# Altium project EmSys_K70Wn_v1.PrjPCB (part 1 of 3)
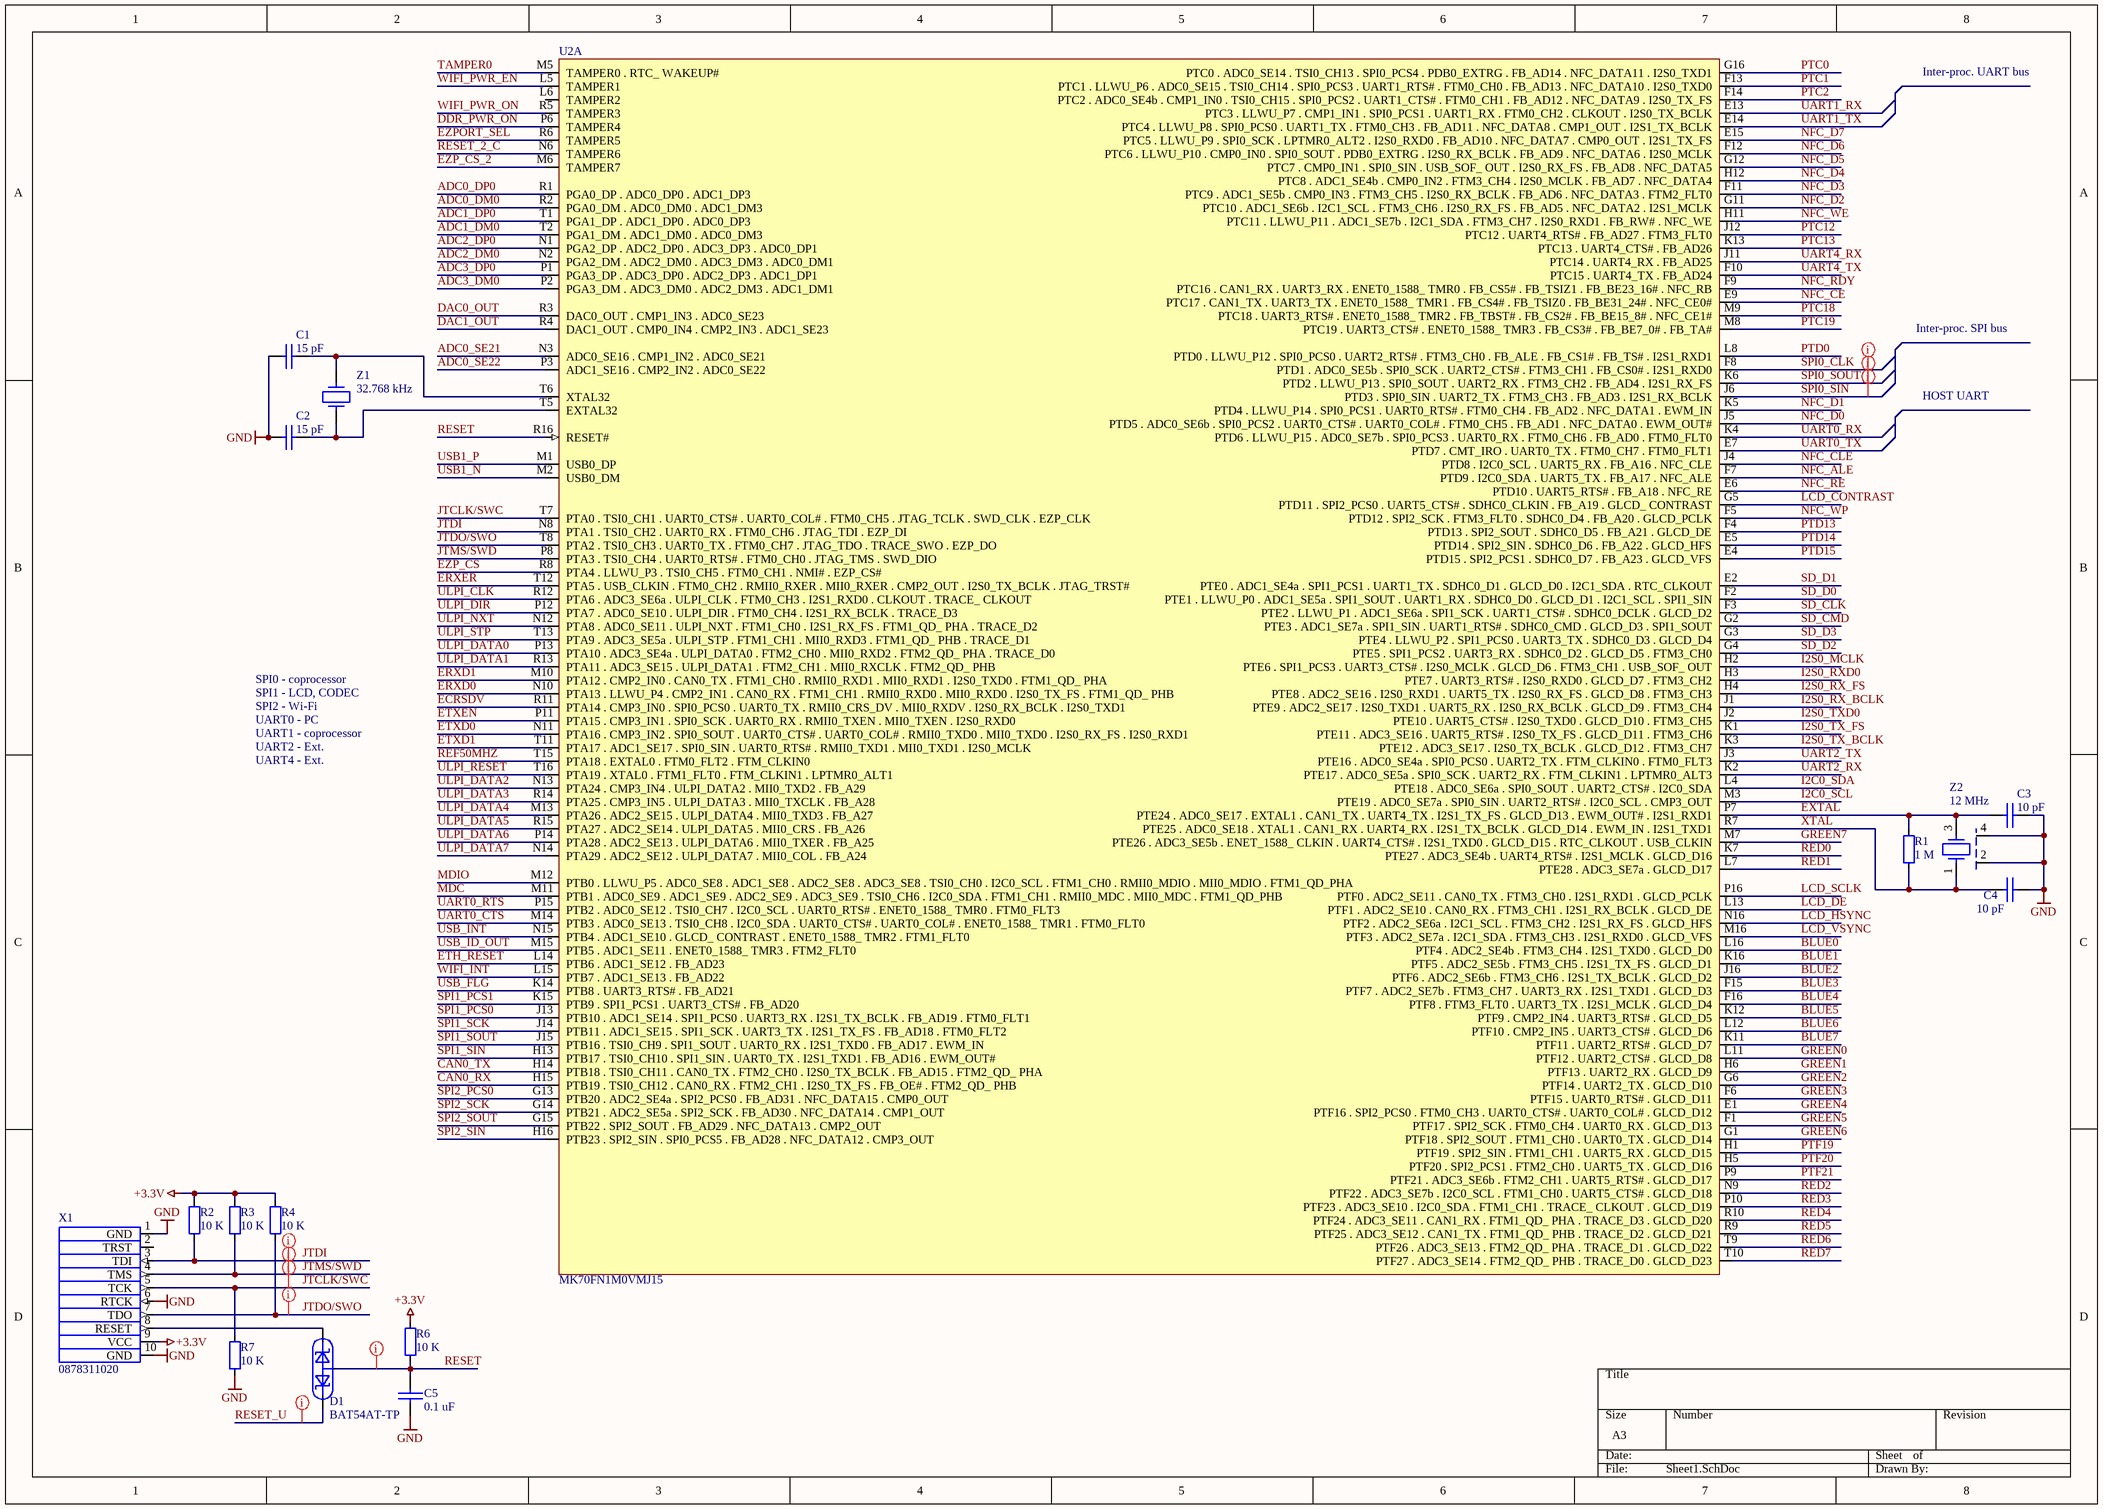
[diagram p0: Sheet1.SchDoc]
7 sheets, 344 parts. Net scope: global (net labels, ports and power ports of the same name join across sheets).
Board file: EMSYS_K70Wn_v1.PcbDoc
Sheets:
  Sheet1.SchDoc
  Sheet2.SchDoc
  Sheet3.SchDoc
  Sheet4.SchDoc
  Sheet5.SchDoc
  Sheet6.SchDoc
  Sheet7.SchDoc

## Sheet Sheet1.SchDoc
size A3; DocumentNumber: 1; SheetNumber: 1; SheetTotal: 7

### Parts
C1  value 15 pF  [1608[0603]]  (hidden comment: CC0603JRNPO9BN150)
C2  value 15 pF  [1608[0603]]  (hidden comment: CC0603JRNPO9BN150)
C3  value 10 pF  [1608[0603]]  (hidden comment: CCPF010K0603)
C4  value 10 pF  [1608[0603]]  (hidden comment: CCPF010K0603)
C5  value 0.1 uF  [1005[0402]]  (hidden comment: CL10B104KA8NNND)
D1  BAT54AT-TP  [SOT-523F]
R1  value 1 M  [0603]  (hidden comment: RC0603FR-071ML)
R2  value 10 K  [0402]  (hidden comment: ERJ-3EKF1002V)
R3  value 10 K  [0402]  (hidden comment: ERJ-3EKF1002V)
R4  value 10 K  [0402]  (hidden comment: ERJ-3EKF1002V)
R6  value 10 K  [0402]  (hidden comment: ERJ-3EKF1002V)
R7  value 10 K  [0402]  (hidden comment: ERJ-3EKF1002V)
U2  MK70FN1M0VMJ15  [MAPBGA 256-pin]  (part A of 2)
X1  0878311020  [878311020 MGRID WALL HDR SMD]
Z1  value 32.768 kHz  [ABS10]  (hidden comment: CM200C32768DZBT)
Z2  value 12 MHz  [DSX321G]  (hidden comment: NX3225SA-12.000MHZ-STD-CSR-1)

### Nets
+3.3V: R2.1 R3.1 R4.1 R6.1 X1.9(VCC)
GND: C1.2 C2.2 C3.2 C4.2 C5.2 R7.2 X1.1(GND) X1.6(RTCK) X1.10(GND) Z2.2 Z2.4
ADC0_DM0: U2.R2(PGA0_DM_._ADC0_DM0_._ADC1_DM3)
ADC0_DP0: U2.R1(PGA0_DP_._ADC0_DP0_._ADC1_DP3)
ADC0_SE21: U2.N3(ADC0_SE16_._CMP1_IN2_._ADC0_SE21)
ADC0_SE22: U2.P3(ADC1_SE16_._CMP2_IN2_._ADC0_SE22)
ADC1_DM0: U2.T2(PGA1_DM_._ADC1_DM0_._ADC0_DM3)
ADC1_DP0: U2.T1(PGA1_DP_._ADC1_DP0_._ADC0_DP3)
ADC2_DM0: U2.N2(PGA2_DM_._ADC2_DM0_._ADC3_DM3_._ADC0_DM1)
ADC2_DP0: U2.N1(PGA2_DP_._ADC2_DP0_._ADC3_DP3_._ADC0_DP1)
ADC3_DM0: U2.P2(PGA3_DM_._ADC3_DM0_._ADC2_DM3_._ADC1_DM1)
ADC3_DP0: U2.P1(PGA3_DP_._ADC3_DP0_._ADC2_DP3_._ADC1_DP1)
BLUE0: U2.L16(PTF4_._ADC2_SE4b_._FTM3_CH4_._I2S1_TXD0_._GLCD_D0)
BLUE1: U2.K16(PTF5_._ADC2_SE5b_._FTM3_CH5_._I2S1_TX_FS_._GLCD_D1)
BLUE2: U2.J16(PTF6_._ADC2_SE6b_._FTM3_CH6_._I2S1_TX_BCLK_._GLCD_D2)
BLUE3: U2.F15(PTF7_._ADC2_SE7b_._FTM3_CH7_._UART3_RX_._I2S1_TXD1_._GLCD_D3)
BLUE4: U2.F16(PTF8_._FTM3_FLT0_._UART3_TX_._I2S1_MCLK_._GLCD_D4)
BLUE5: U2.K12(PTF9_._CMP2_IN4_._UART3_RTS#_._GLCD_D5)
BLUE6: U2.L12(PTF10_._CMP2_IN5_._UART3_CTS#_._GLCD_D6)
BLUE7: U2.K11(PTF11_._UART2_RTS#_._GLCD_D7)
CAN0_RX: U2.H15(PTB19_._TSI0_CH12_._CAN0_RX_._FTM2_CH1_._I2S0_TX_FS_._FB_OE#_._FTM2_QD__PHB)
CAN0_TX: U2.H14(PTB18_._TSI0_CH11_._CAN0_TX_._FTM2_CH0_._I2S0_TX_BCLK_._FB_AD15_._FTM2_QD__PHA)
DAC0_OUT: U2.R3(DAC0_OUT_._CMP1_IN3_._ADC0_SE23)
DAC1_OUT: U2.R4(DAC1_OUT_._CMP0_IN4_._CMP2_IN3_._ADC1_SE23)
DDR_PWR_ON: U2.P6(TAMPER4)
ECRSDV: U2.R11(PTA14_._CMP3_IN0_._SPI0_PCS0_._UART0_TX_._RMII0_CRS_DV_._MII0_RXDV_._I2S0_RX_BCLK_._I2S0_TXD1)
ERXD0: U2.N10(PTA13_._LLWU_P4_._CMP2_IN1_._CAN0_RX_._FTM1_CH1_._RMII0_RXD0_._MII0_RXD0_._I2S0_TX_FS_._FTM1_QD__PHB)
ERXD1: U2.M10(PTA12_._CMP2_IN0_._CAN0_TX_._FTM1_CH0_._RMII0_RXD1_._MII0_RXD1_._I2S0_TXD0_._FTM1_QD__PHA)
ERXER: U2.T12(PTA5_._USB_CLKIN_._FTM0_CH2_._RMII0_RXER_._MII0_RXER_._CMP2_OUT_._I2S0_TX_BCLK_._JTAG_TRST#)
ETH_RESET: U2.L14(PTB6_._ADC1_SE12_._FB_AD23)
ETXD0: U2.N11(PTA16_._CMP3_IN2_._SPI0_SOUT_._UART0_CTS#_._UART0_COL#_._RMII0_TXD0_._MII0_TXD0_._I2S0_RX_FS_._I2S0_RXD1)
ETXD1: U2.T11(PTA17_._ADC1_SE17_._SPI0_SIN_._UART0_RTS#_._RMII0_TXD1_._MII0_TXD1_._I2S0_MCLK)
ETXEN: U2.P11(PTA15_._CMP3_IN1_._SPI0_SCK_._UART0_RX_._RMII0_TXEN_._MII0_TXEN_._I2S0_RXD0)
EXTAL: C3.1 R1.2 U2.P7(PTE24_._ADC0_SE17_._EXTAL1_._CAN1_TX_._UART4_TX_._I2S1_TX_FS_._GLCD_D13_._EWM_OUT#_._I2S1_RXD1) Z2.3
EZP_CS: U2.R8(PTA4_._LLWU_P3_._TSI0_CH5_._FTM0_CH1_._NMI#_._EZP_CS#)
EZP_CS_2: U2.M6(TAMPER7)
EZPORT_SEL: U2.R6(TAMPER5)
GREEN0: U2.L11(PTF12_._UART2_CTS#_._GLCD_D8)
GREEN1: U2.H6(PTF13_._UART2_RX_._GLCD_D9)
GREEN2: U2.G6(PTF14_._UART2_TX_._GLCD_D10)
GREEN3: U2.F6(PTF15_._UART0_RTS#_._GLCD_D11)
GREEN4: U2.E1(PTF16_._SPI2_PCS0_._FTM0_CH3_._UART0_CTS#_._UART0_COL#_._GLCD_D12)
GREEN5: U2.F1(PTF17_._SPI2_SCK_._FTM0_CH4_._UART0_RX_._GLCD_D13)
GREEN6: U2.G1(PTF18_._SPI2_SOUT_._FTM1_CH0_._UART0_TX_._GLCD_D14)
GREEN7: U2.M7(PTE26_._ADC3_SE5b_._ENET_1588__CLKIN_._UART4_CTS#_._I2S1_TXD0_._GLCD_D15_._RTC_CLKOUT_._USB_CLKIN)
I2C0_SCL: U2.M3(PTE19_._ADC0_SE7a_._SPI0_SIN_._UART2_RTS#_._I2C0_SCL_._CMP3_OUT)
I2C0_SDA: U2.L4(PTE18_._ADC0_SE6a_._SPI0_SOUT_._UART2_CTS#_._I2C0_SDA)
I2S0_MCLK: U2.H2(PTE6_._SPI1_PCS3_._UART3_CTS#_._I2S0_MCLK_._GLCD_D6_._FTM3_CH1_._USB_SOF__OUT)
I2S0_RX_BCLK: U2.J1(PTE9_._ADC2_SE17_._I2S0_TXD1_._UART5_RX_._I2S0_RX_BCLK_._GLCD_D9_._FTM3_CH4)
I2S0_RX_FS: U2.H4(PTE8_._ADC2_SE16_._I2S0_RXD1_._UART5_TX_._I2S0_RX_FS_._GLCD_D8_._FTM3_CH3)
I2S0_RXD0: U2.H3(PTE7_._UART3_RTS#_._I2S0_RXD0_._GLCD_D7_._FTM3_CH2)
I2S0_TX_BCLK: U2.K3(PTE12_._ADC3_SE17_._I2S0_TX_BCLK_._GLCD_D12_._FTM3_CH7)
I2S0_TX_FS: U2.K1(PTE11_._ADC3_SE16_._UART5_RTS#_._I2S0_TX_FS_._GLCD_D11_._FTM3_CH6)
I2S0_TXD0: U2.J2(PTE10_._UART5_CTS#_._I2S0_TXD0_._GLCD_D10_._FTM3_CH5)
JTCLK/SWC: R7.1 U2.T7(PTA0_._TSI0_CH1_._UART0_CTS#_._UART0_COL#_._FTM0_CH5_._JTAG_TCLK_._SWD_CLK_._EZP_CLK) X1.5(TCK)
JTDI: R2.2 U2.N8(PTA1_._TSI0_CH2_._UART0_RX_._FTM0_CH6_._JTAG_TDI_._EZP_DI) X1.3(TDI)
JTDO/SWO: R4.2 U2.T8(PTA2_._TSI0_CH3_._UART0_TX_._FTM0_CH7_._JTAG_TDO_._TRACE_SWO_._EZP_DO) X1.7(TDO)
JTMS/SWD: R3.2 U2.P8(PTA3_._TSI0_CH4_._UART0_RTS#_._FTM0_CH0_._JTAG_TMS_._SWD_DIO) X1.4(TMS)
LCD_CONTRAST: U2.G5(PTD11_._SPI2_PCS0_._UART5_CTS#_._SDHC0_CLKIN_._FB_A19_._GLCD__CONTRAST)
LCD_DE: U2.L13(PTF1_._ADC2_SE10_._CAN0_RX_._FTM3_CH1_._I2S1_RX_BCLK_._GLCD_DE)
LCD_HSYNC: U2.N16(PTF2_._ADC2_SE6a_._I2C1_SCL_._FTM3_CH2_._I2S1_RX_FS_._GLCD_HFS)
LCD_SCLK: U2.P16(PTF0_._ADC2_SE11_._CAN0_TX_._FTM3_CH0_._I2S1_RXD1_._GLCD_PCLK)
LCD_VSYNC: U2.M16(PTF3_._ADC2_SE7a_._I2C1_SDA_._FTM3_CH3_._I2S1_RXD0_._GLCD_VFS)
MDC: U2.M11(PTB1_._ADC0_SE9_._ADC1_SE9_._ADC2_SE9_._ADC3_SE9_._TSI0_CH6_._I2C0_SDA_._FTM1_CH1_._RMII0_MDC_._MII0_MDC_._FTM1_QD_PHB)
MDIO: U2.M12(PTB0_._LLWU_P5_._ADC0_SE8_._ADC1_SE8_._ADC2_SE8_._ADC3_SE8_._TSI0_CH0_._I2C0_SCL_._FTM1_CH0_._RMII0_MDIO_._MII0_MDIO_._FTM1_QD_PHA)
NFC_ALE: U2.F7(PTD9_._I2C0_SDA_._UART5_TX_._FB_A17_._NFC_ALE)
NFC_CE: U2.E9(PTC17_._CAN1_TX_._UART3_TX_._ENET0_1588__TMR1_._FB_CS4#_._FB_TSIZ0_._FB_BE31_24#_._NFC_CE0#)
NFC_CLE: U2.J4(PTD8_._I2C0_SCL_._UART5_RX_._FB_A16_._NFC_CLE)
NFC_D0: U2.J5(PTD5_._ADC0_SE6b_._SPI0_PCS2_._UART0_CTS#_._UART0_COL#_._FTM0_CH5_._FB_AD1_._NFC_DATA0_._EWM_OUT#)
NFC_D1: U2.K5(PTD4_._LLWU_P14_._SPI0_PCS1_._UART0_RTS#_._FTM0_CH4_._FB_AD2_._NFC_DATA1_._EWM_IN)
NFC_D2: U2.G11(PTC10_._ADC1_SE6b_._I2C1_SCL_._FTM3_CH6_._I2S0_RX_FS_._FB_AD5_._NFC_DATA2_._I2S1_MCLK)
NFC_D3: U2.F11(PTC9_._ADC1_SE5b_._CMP0_IN3_._FTM3_CH5_._I2S0_RX_BCLK_._FB_AD6_._NFC_DATA3_._FTM2_FLT0)
NFC_D4: U2.H12(PTC8_._ADC1_SE4b_._CMP0_IN2_._FTM3_CH4_._I2S0_MCLK_._FB_AD7_._NFC_DATA4)
NFC_D5: U2.G12(PTC7_._CMP0_IN1_._SPI0_SIN_._USB_SOF__OUT_._I2S0_RX_FS_._FB_AD8_._NFC_DATA5)
NFC_D6: U2.F12(PTC6_._LLWU_P10_._CMP0_IN0_._SPI0_SOUT_._PDB0_EXTRG_._I2S0_RX_BCLK_._FB_AD9_._NFC_DATA6_._I2S0_MCLK)
NFC_D7: U2.E15(PTC5_._LLWU_P9_._SPI0_SCK_._LPTMR0_ALT2_._I2S0_RXD0_._FB_AD10_._NFC_DATA7_._CMP0_OUT_._I2S1_TX_FS)
NFC_RDY: U2.F9(PTC16_._CAN1_RX_._UART3_RX_._ENET0_1588__TMR0_._FB_CS5#_._FB_TSIZ1_._FB_BE23_16#_._NFC_RB)
NFC_RE: U2.E6(PTD10_._UART5_RTS#_._FB_A18_._NFC_RE)
NFC_WE: U2.H11(PTC11_._LLWU_P11_._ADC1_SE7b_._I2C1_SDA_._FTM3_CH7_._I2S0_RXD1_._FB_RW#_._NFC_WE)
NFC_WP: U2.F5(PTD12_._SPI2_SCK_._FTM3_FLT0_._SDHC0_D4_._FB_A20_._GLCD_PCLK)
PTC0: U2.G16(PTC0_._ADC0_SE14_._TSI0_CH13_._SPI0_PCS4_._PDB0_EXTRG_._FB_AD14_._NFC_DATA11_._I2S0_TXD1)
PTC1: U2.F13(PTC1_._LLWU_P6_._ADC0_SE15_._TSI0_CH14_._SPI0_PCS3_._UART1_RTS#_._FTM0_CH0_._FB_AD13_._NFC_DATA10_._I2S0_TXD0)
PTC2: U2.F14(PTC2_._ADC0_SE4b_._CMP1_IN0_._TSI0_CH15_._SPI0_PCS2_._UART1_CTS#_._FTM0_CH1_._FB_AD12_._NFC_DATA9_._I2S0_TX_FS)
PTC12: U2.J12(PTC12_._UART4_RTS#_._FB_AD27_._FTM3_FLT0)
PTC13: U2.K13(PTC13_._UART4_CTS#_._FB_AD26)
PTC18: U2.M9(PTC18_._UART3_RTS#_._ENET0_1588__TMR2_._FB_TBST#_._FB_CS2#_._FB_BE15_8#_._NFC_CE1#)
PTC19: U2.M8(PTC19_._UART3_CTS#_._ENET0_1588__TMR3_._FB_CS3#_._FB_BE7_0#_._FB_TA#)
PTD0: U2.L8(PTD0_._LLWU_P12_._SPI0_PCS0_._UART2_RTS#_._FTM3_CH0_._FB_ALE_._FB_CS1#_._FB_TS#_._I2S1_RXD1)
PTD13: U2.F4(PTD13_._SPI2_SOUT_._SDHC0_D5_._FB_A21_._GLCD_DE)
PTD14: U2.E5(PTD14_._SPI2_SIN_._SDHC0_D6_._FB_A22_._GLCD_HFS)
PTD15: U2.E4(PTD15_._SPI2_PCS1_._SDHC0_D7_._FB_A23_._GLCD_VFS)
PTF19: U2.H1(PTF19_._SPI2_SIN_._FTM1_CH1_._UART5_RX_._GLCD_D15)
PTF20: U2.H5(PTF20_._SPI2_PCS1_._FTM2_CH0_._UART5_TX_._GLCD_D16)
PTF21: U2.P9(PTF21_._ADC3_SE6b_._FTM2_CH1_._UART5_RTS#_._GLCD_D17)
RED0: U2.K7(PTE27_._ADC3_SE4b_._UART4_RTS#_._I2S1_MCLK_._GLCD_D16)
RED1: U2.L7(PTE28_._ADC3_SE7a_._GLCD_D17)
RED2: U2.N9(PTF22_._ADC3_SE7b_._I2C0_SCL_._FTM1_CH0_._UART5_CTS#_._GLCD_D18)
RED3: U2.P10(PTF23_._ADC3_SE10_._I2C0_SDA_._FTM1_CH1_._TRACE__CLKOUT_._GLCD_D19)
RED4: U2.R10(PTF24_._ADC3_SE11_._CAN1_RX_._FTM1_QD__PHA_._TRACE_D3_._GLCD_D20)
RED5: U2.R9(PTF25_._ADC3_SE12_._CAN1_TX_._FTM1_QD__PHB_._TRACE_D2_._GLCD_D21)
RED6: U2.T9(PTF26_._ADC3_SE13_._FTM2_QD__PHA_._TRACE_D1_._GLCD_D22)
RED7: U2.T10(PTF27_._ADC3_SE14_._FTM2_QD__PHB_._TRACE_D0_._GLCD_D23)
REF50MHZ: U2.T15(PTA18_._EXTAL0_._FTM0_FLT2_._FTM_CLKIN0)
RESET: C5.1 D1.3 R6.2 U2.R16(RESET#)
RESET_2_C: U2.N6(TAMPER6)
RESET_U: D1.2
SD_CLK: U2.F3(PTE2_._LLWU_P1_._ADC1_SE6a_._SPI1_SCK_._UART1_CTS#_._SDHC0_DCLK_._GLCD_D2)
SD_CMD: U2.G2(PTE3_._ADC1_SE7a_._SPI1_SIN_._UART1_RTS#_._SDHC0_CMD_._GLCD_D3_._SPI1_SOUT)
SD_D0: U2.F2(PTE1_._LLWU_P0_._ADC1_SE5a_._SPI1_SOUT_._UART1_RX_._SDHC0_D0_._GLCD_D1_._I2C1_SCL_._SPI1_SIN)
SD_D1: U2.E2(PTE0_._ADC1_SE4a_._SPI1_PCS1_._UART1_TX_._SDHC0_D1_._GLCD_D0_._I2C1_SDA_._RTC_CLKOUT)
SD_D2: U2.G4(PTE5_._SPI1_PCS2_._UART3_RX_._SDHC0_D2_._GLCD_D5_._FTM3_CH0)
SD_D3: U2.G3(PTE4_._LLWU_P2_._SPI1_PCS0_._UART3_TX_._SDHC0_D3_._GLCD_D4)
SPI0_CLK: U2.F8(PTD1_._ADC0_SE5b_._SPI0_SCK_._UART2_CTS#_._FTM3_CH1_._FB_CS0#_._I2S1_RXD0)
SPI0_SIN: U2.J6(PTD3_._SPI0_SIN_._UART2_TX_._FTM3_CH3_._FB_AD3_._I2S1_RX_BCLK)
SPI0_SOUT: U2.K6(PTD2_._LLWU_P13_._SPI0_SOUT_._UART2_RX_._FTM3_CH2_._FB_AD4_._I2S1_RX_FS)
SPI1_PCS0: U2.J13(PTB10_._ADC1_SE14_._SPI1_PCS0_._UART3_RX_._I2S1_TX_BCLK_._FB_AD19_._FTM0_FLT1)
SPI1_PCS1: U2.K15(PTB9_._SPI1_PCS1_._UART3_CTS#_._FB_AD20)
SPI1_SCK: U2.J14(PTB11_._ADC1_SE15_._SPI1_SCK_._UART3_TX_._I2S1_TX_FS_._FB_AD18_._FTM0_FLT2)
SPI1_SIN: U2.H13(PTB17_._TSI0_CH10_._SPI1_SIN_._UART0_TX_._I2S1_TXD1_._FB_AD16_._EWM_OUT#)
SPI1_SOUT: U2.J15(PTB16_._TSI0_CH9_._SPI1_SOUT_._UART0_RX_._I2S1_TXD0_._FB_AD17_._EWM_IN)
SPI2_PCS0: U2.G13(PTB20_._ADC2_SE4a_._SPI2_PCS0_._FB_AD31_._NFC_DATA15_._CMP0_OUT)
SPI2_SCK: U2.G14(PTB21_._ADC2_SE5a_._SPI2_SCK_._FB_AD30_._NFC_DATA14_._CMP1_OUT)
SPI2_SIN: U2.H16(PTB23_._SPI2_SIN_._SPI0_PCS5_._FB_AD28_._NFC_DATA12_._CMP3_OUT)
SPI2_SOUT: U2.G15(PTB22_._SPI2_SOUT_._FB_AD29_._NFC_DATA13_._CMP2_OUT)
TAMPER0: U2.M5(TAMPER0_._RTC__WAKEUP#)
UART0_CTS: U2.M14(PTB3_._ADC0_SE13_._TSI0_CH8_._I2C0_SDA_._UART0_CTS#_._UART0_COL#_._ENET0_1588__TMR1_._FTM0_FLT0)
UART0_RTS: U2.P15(PTB2_._ADC0_SE12_._TSI0_CH7_._I2C0_SCL_._UART0_RTS#_._ENET0_1588__TMR0_._FTM0_FLT3)
UART0_RX: U2.K4(PTD6_._LLWU_P15_._ADC0_SE7b_._SPI0_PCS3_._UART0_RX_._FTM0_CH6_._FB_AD0_._FTM0_FLT0)
UART0_TX: U2.E7(PTD7_._CMT_IRO_._UART0_TX_._FTM0_CH7_._FTM0_FLT1)
UART1_RX: U2.E13(PTC3_._LLWU_P7_._CMP1_IN1_._SPI0_PCS1_._UART1_RX_._FTM0_CH2_._CLKOUT_._I2S0_TX_BCLK)
UART1_TX: U2.E14(PTC4_._LLWU_P8_._SPI0_PCS0_._UART1_TX_._FTM0_CH3_._FB_AD11_._NFC_DATA8_._CMP1_OUT_._I2S1_TX_BCLK)
UART2_RX: U2.K2(PTE17_._ADC0_SE5a_._SPI0_SCK_._UART2_RX_._FTM_CLKIN1_._LPTMR0_ALT3)
UART2_TX: U2.J3(PTE16_._ADC0_SE4a_._SPI0_PCS0_._UART2_TX_._FTM_CLKIN0_._FTM0_FLT3)
UART4_RX: U2.J11(PTC14_._UART4_RX_._FB_AD25)
UART4_TX: U2.F10(PTC15_._UART4_TX_._FB_AD24)
ULPI_CLK: U2.R12(PTA6_._ADC3_SE6a_._ULPI_CLK_._FTM0_CH3_._I2S1_RXD0_._CLKOUT_._TRACE__CLKOUT)
ULPI_DATA0: U2.P13(PTA10_._ADC3_SE4a_._ULPI_DATA0_._FTM2_CH0_._MII0_RXD2_._FTM2_QD__PHA_._TRACE_D0)
ULPI_DATA1: U2.R13(PTA11_._ADC3_SE15_._ULPI_DATA1_._FTM2_CH1_._MII0_RXCLK_._FTM2_QD__PHB)
ULPI_DATA2: U2.N13(PTA24_._CMP3_IN4_._ULPI_DATA2_._MII0_TXD2_._FB_A29)
ULPI_DATA3: U2.R14(PTA25_._CMP3_IN5_._ULPI_DATA3_._MII0_TXCLK_._FB_A28)
ULPI_DATA4: U2.M13(PTA26_._ADC2_SE15_._ULPI_DATA4_._MII0_TXD3_._FB_A27)
ULPI_DATA5: U2.R15(PTA27_._ADC2_SE14_._ULPI_DATA5_._MII0_CRS_._FB_A26)
ULPI_DATA6: U2.P14(PTA28_._ADC2_SE13_._ULPI_DATA6_._MII0_TXER_._FB_A25)
ULPI_DATA7: U2.N14(PTA29_._ADC2_SE12_._ULPI_DATA7_._MII0_COL_._FB_A24)
ULPI_DIR: U2.P12(PTA7_._ADC0_SE10_._ULPI_DIR_._FTM0_CH4_._I2S1_RX_BCLK_._TRACE_D3)
ULPI_NXT: U2.N12(PTA8_._ADC0_SE11_._ULPI_NXT_._FTM1_CH0_._I2S1_RX_FS_._FTM1_QD__PHA_._TRACE_D2)
ULPI_RESET: U2.T16(PTA19_._XTAL0_._FTM1_FLT0_._FTM_CLKIN1_._LPTMR0_ALT1)
ULPI_STP: U2.T13(PTA9_._ADC3_SE5a_._ULPI_STP_._FTM1_CH1_._MII0_RXD3_._FTM1_QD__PHB_._TRACE_D1)
USB1_N: U2.M2(USB0_DM)
USB1_P: U2.M1(USB0_DP)
USB_FLG: U2.K14(PTB8_._UART3_RTS#_._FB_AD21)
USB_ID_OUT: U2.M15(PTB5_._ADC1_SE11_._ENET0_1588__TMR3_._FTM2_FLT0)
USB_INT: U2.N15(PTB4_._ADC1_SE10_._GLCD__CONTRAST_._ENET0_1588__TMR2_._FTM1_FLT0)
WIFI_INT: U2.L15(PTB7_._ADC1_SE13_._FB_AD22)
WIFI_PWR_EN: U2.L5(TAMPER1)
WIFI_PWR_ON: U2.R5(TAMPER3)
XTAL: C4.1 R1.1 U2.R7(PTE25_._ADC0_SE18_._XTAL1_._CAN1_RX_._UART4_RX_._I2S1_TX_BCLK_._GLCD_D14_._EWM_IN_._I2S1_TXD1) Z2.1
NetC1_1: C1.1 U2.T6(XTAL32) Z1.1
NetC2_1: C2.1 U2.T5(EXTAL32) Z1.2
NetD1_1: D1.1 X1.8(RESET)

Not connected (* = marked no-connect by the designer): U2 L6(TAMPER2); X1 2(TRST)

### Layout directives
net class JTAG1: JTCLK/SWC, JTDI, JTDO/SWO, JTMS/SWD, RESET, RESET_U
net class IPC_SPI: SPI0_CLK, SPI0_SIN, SPI0_SOUT

### Notes on the sheet
- Inter-proc. UART bus
- Inter-proc. SPI bus
- HOST UART
- SPI0 - coprocessor
- SPI1 - LCD, CODEC
- SPI2 - Wi-Fi
- UART0 - PC
- UART1 - coprocessor
- UART2 - Ext.
- UART4 - Ext.

### Library data of the parts
C1 C2 = CCPF015K0603: 15 pF, 50V, 5%, NP0, 0603 SMD MLC Capacitor; Manufacturer: YAGEO AMERICA CORPORATION; Tolerance: 5%; Price: 0.003$; Distributor: Future; PartNum: CC0603JRNPO9BN150; Voltage: 50 V; PartName: CC0603JRNPO9BN150; Price50: 0.003$; Price100: 0.003$; Price1000: 0.003$
C3 C4 = CCPF010K0603: 10 pF, 50V, 5%, NP0, 0603 SMD MLC Capacitor; Manufacturer: Kemet; PartNum: 399-1049-1-ND; PartName: C0603C100J5GACTU; Tolerance: 5%; Price: 0.0075$; Distributor: Digi-Key; Voltage: 50 V
C5 = GRM155R71C104KA88D: 0.1 uF, 16V, 10%, X7R, 0402; Manufacturer: Murata; PartNum: 490-3261-1-ND; Tolerance: 10%; Distributor: Digi-Key; Price: 0.005$; Voltage: 16 V
D1 = BAT54AT-TP: Schottky Diode, 30 V, 200 mA, common anode, SOT523; Manufacturer: Micro Commercial Co; PartNum: BAT54AT-TPDKR-ND; Distributor: Digi-Key; Price: 0.52$; PartName: BAT54AT-TP
R1 = RC0603FR-071ML: 1 M, 1%, 0603, SMD Resistor, Taped; Manufacturer: YAGEO AMERICA CORPORATION; Voltage: 75 V; Distributor: Future; Price: 0.002 Euro; Tolerance: 1%; PartNum: RC0603FR-071ML; PartName: RC0603FR-071ML
R2-R4 R6 R7 = RC0402JR-0710KL: 10 K, 5%, 0402, SMD Resistor, Taped; Manufacturer: Yageo; PartNum: 311-10KJRCT-ND; Voltage: 75 V; Distributor: Digi-Key; Price: 0.1$; Tolerance: 5%; PartName: RC0402JR-0710KL
U2 = MK70FN1M0VMJ15: 32-Bit 150 Mhz ARM 1MB FLASH 256MAPBGA; Manufacturer: Freescale; PartNum: MK70FN1M0VMJ15-ND; PartName: MK70FN1M0VMJ15; Price: 16.5$; Distributor: Digi-Key
X1 = 0878321020: JTAG, CONN HEADER 10POS 2MM VERT SMD; Manufacturer: Molex Inc; PartNum: WM18639-ND; Distributor: Digi-Key; Price: 1.29$; PartName: 0878321020
Z1 = ABS10-32.768KHZ-T: 32.768 kHz, 12.5 pF, 70 kOhm, ±20ppm, -40°C ~ 80°C; Manufacturer: Abracon Corporation; PartNum: 535-9536-1-ND; Price: 0.82$; Tolerance: 20 ppm; Distributor: Digi-Key; PartName: ABS10-32.768KHZ-T
Z2 = NX3225SA-12.000MHZ-STD-CSR-1: 12 MHz, 8 pF, ±15ppm, -10...+75 С; Manufacturer: NDK; PartNum: 644-1047-1-ND; Price: 1$; Distributor: Digi-Key; Tolerance: 15 ppm; PartName: NX3225SA-12.000MHZ-STD-CSR-1

## Sheet Sheet2.SchDoc
size A3; DocumentNumber: 2; SheetNumber: 2; SheetTotal: 7
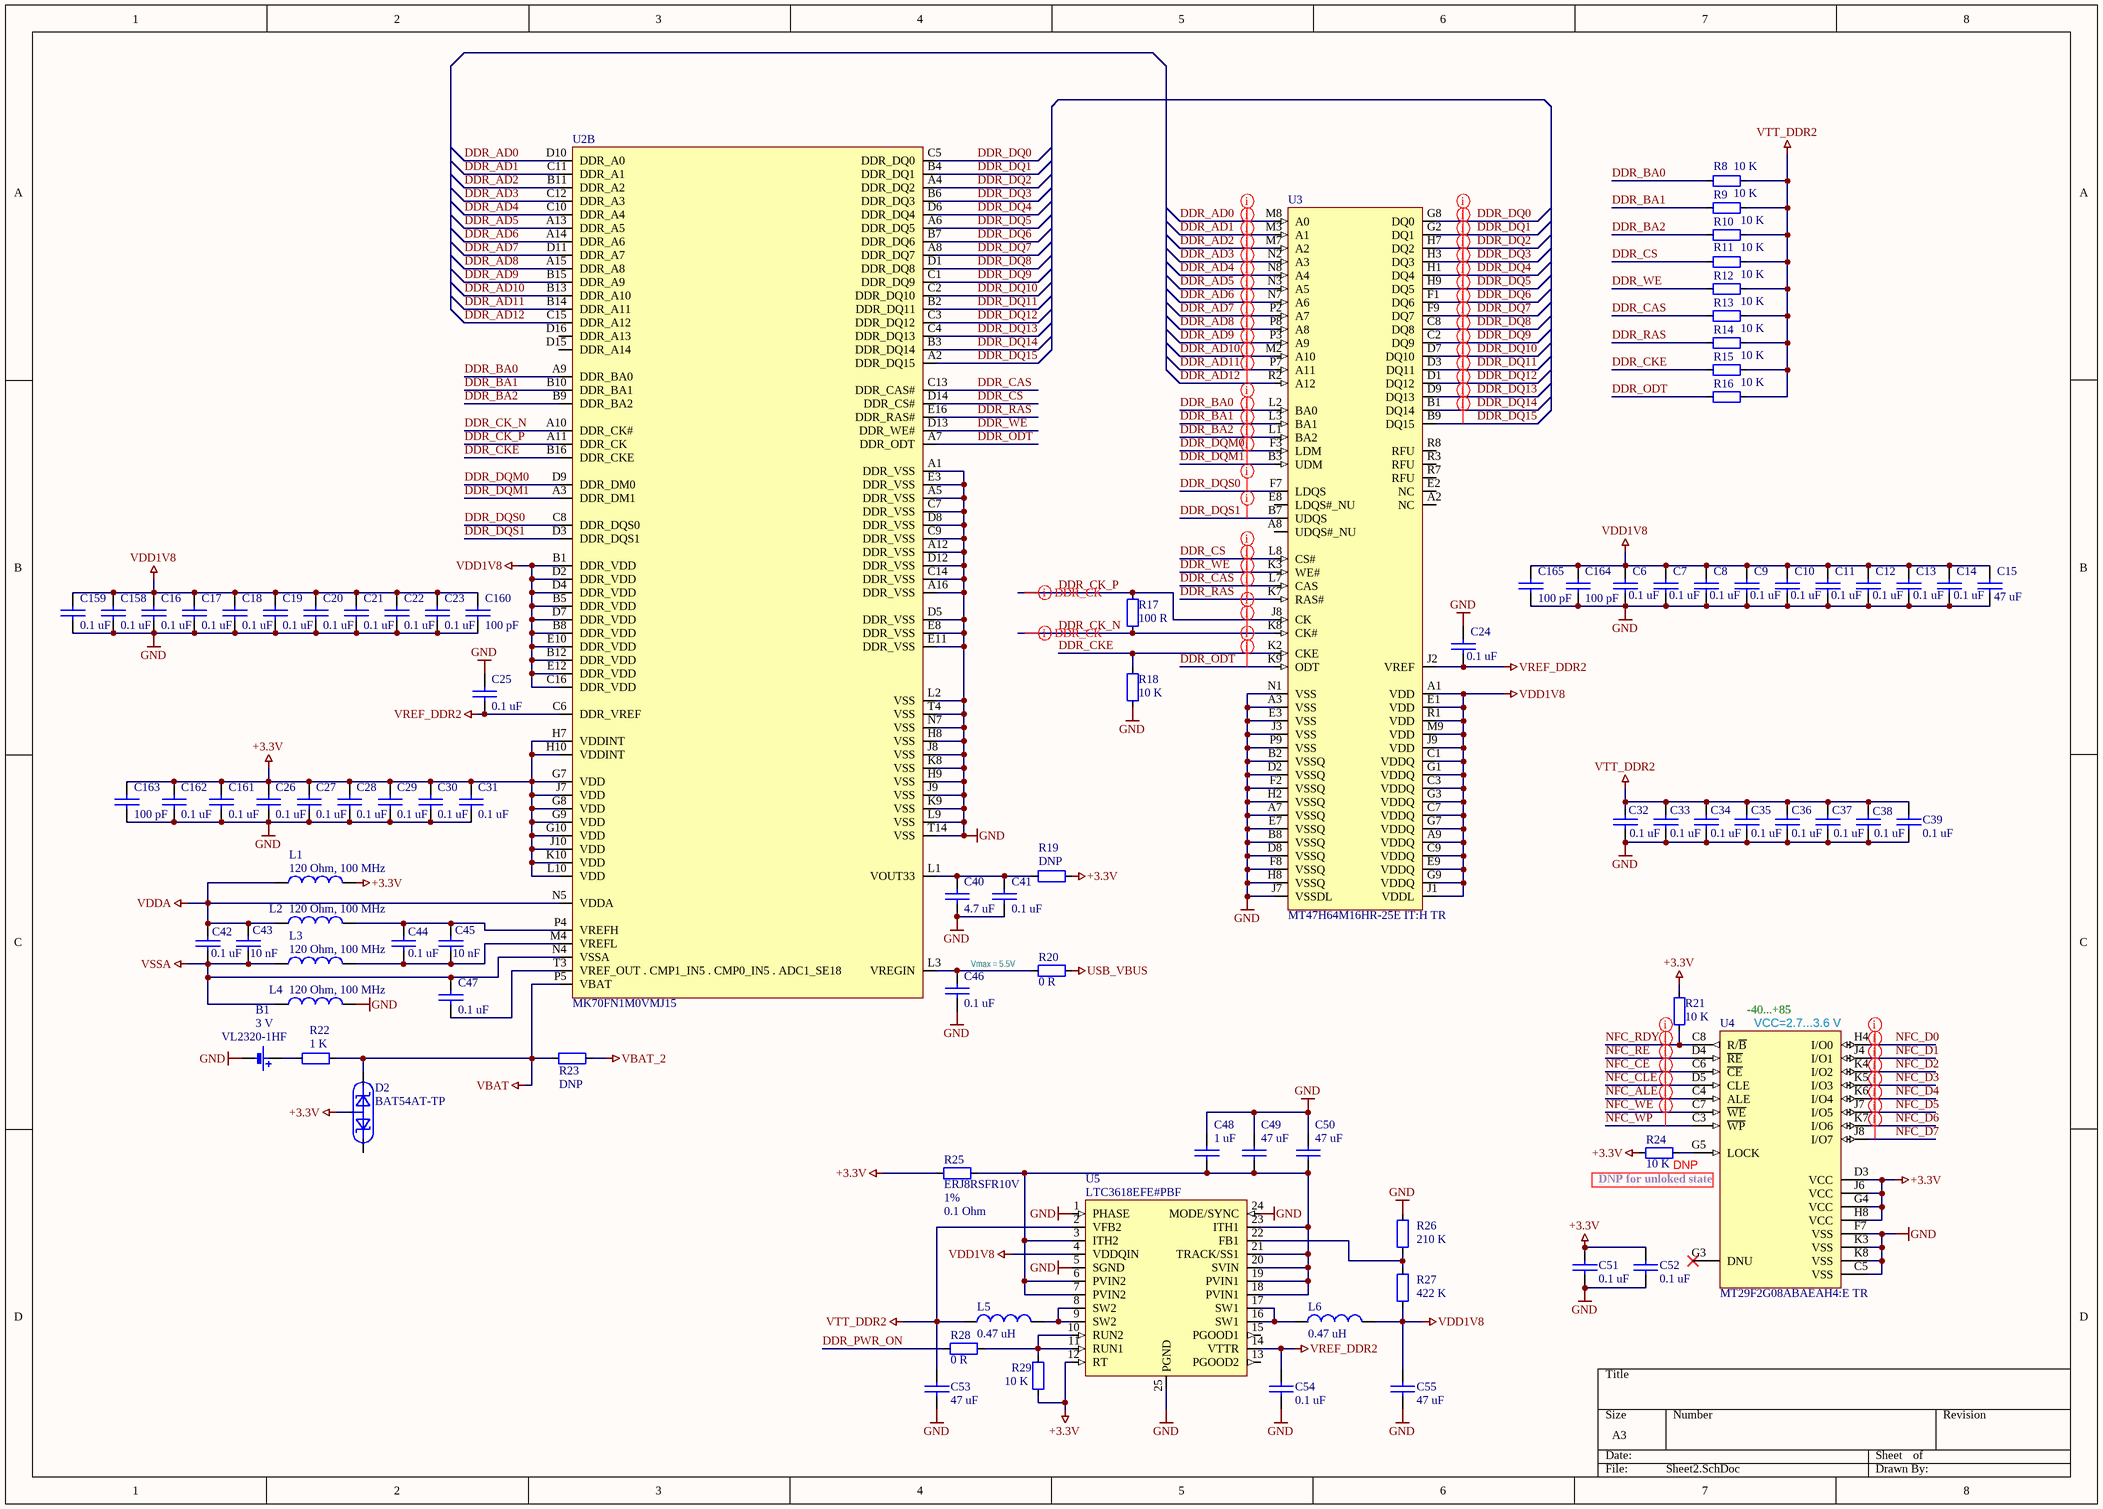
[diagram p1: Sheet2.SchDoc]

### Parts
B1  VL2320-1HF  value 3 V  [SANYO ML2430]
C6  value 0.1 uF  [1005[0402]]  (hidden comment: CL10B104KA8NNND)
C7  value 0.1 uF  [1005[0402]]  (hidden comment: CL10B104KA8NNND)
C8  value 0.1 uF  [1005[0402]]  (hidden comment: CL10B104KA8NNND)
C9  value 0.1 uF  [1005[0402]]  (hidden comment: CL10B104KA8NNND)
C10  value 0.1 uF  [1005[0402]]  (hidden comment: CL10B104KA8NNND)
C11  value 0.1 uF  [1005[0402]]  (hidden comment: CL10B104KA8NNND)
C12  value 0.1 uF  [1005[0402]]  (hidden comment: CL10B104KA8NNND)
C13  value 0.1 uF  [1005[0402]]  (hidden comment: CL10B104KA8NNND)
C14  value 0.1 uF  [1005[0402]]  (hidden comment: CL10B104KA8NNND)
C15  value 47 uF  [3225[1210]]  (hidden comment: GRM32ER71A476KE15L)
C16  value 0.1 uF  [1005[0402]]  (hidden comment: CL10B104KA8NNND)
C17  value 0.1 uF  [1005[0402]]  (hidden comment: CL10B104KA8NNND)
C18  value 0.1 uF  [1005[0402]]  (hidden comment: CL10B104KA8NNND)
C19  value 0.1 uF  [1005[0402]]  (hidden comment: CL10B104KA8NNND)
C20  value 0.1 uF  [1005[0402]]  (hidden comment: CL10B104KA8NNND)
C21  value 0.1 uF  [1005[0402]]  (hidden comment: CL10B104KA8NNND)
C22  value 0.1 uF  [1005[0402]]  (hidden comment: CL10B104KA8NNND)
C23  value 0.1 uF  [1005[0402]]  (hidden comment: CL10B104KA8NNND)
C24  value 0.1 uF  [1005[0402]]  (hidden comment: CL10B104KA8NNND)
C25  value 0.1 uF  [1005[0402]]  (hidden comment: CL10B104KA8NNND)
C26  value 0.1 uF  [1005[0402]]  (hidden comment: CL10B104KA8NNND)
C27  value 0.1 uF  [1005[0402]]  (hidden comment: CL10B104KA8NNND)
C28  value 0.1 uF  [1005[0402]]  (hidden comment: CL10B104KA8NNND)
C29  value 0.1 uF  [1005[0402]]  (hidden comment: CL10B104KA8NNND)
C30  value 0.1 uF  [1005[0402]]  (hidden comment: CL10B104KA8NNND)
C31  value 0.1 uF  [1005[0402]]  (hidden comment: CL10B104KA8NNND)
C32  value 0.1 uF  [1005[0402]]  (hidden comment: CL10B104KA8NNND)
C33  value 0.1 uF  [1005[0402]]  (hidden comment: CL10B104KA8NNND)
C34  value 0.1 uF  [1005[0402]]  (hidden comment: CL10B104KA8NNND)
C35  value 0.1 uF  [1005[0402]]  (hidden comment: CL10B104KA8NNND)
C36  value 0.1 uF  [1005[0402]]  (hidden comment: CL10B104KA8NNND)
C37  value 0.1 uF  [1005[0402]]  (hidden comment: CL10B104KA8NNND)
C38  value 0.1 uF  [1005[0402]]  (hidden comment: CL10B104KA8NNND)
C39  value 0.1 uF  [1005[0402]]  (hidden comment: CL10B104KA8NNND)
C40  value 4.7 uF  [1608[0603]]  (hidden comment: LMK107BJ475KA-T)
C41  value 0.1 uF  [1005[0402]]  (hidden comment: CL10B104KA8NNND)
C42  value 0.1 uF  [1005[0402]]  (hidden comment: CL10B104KA8NNND)
C43  value 10 nF  [1005[0402]]  (hidden comment: CL05B103KB5NNNC)
C44  value 0.1 uF  [1005[0402]]  (hidden comment: CL10B104KA8NNND)
C45  value 10 nF  [1005[0402]]  (hidden comment: CL05B103KB5NNNC)
C46  value 0.1 uF  [1005[0402]]  (hidden comment: CL10B104KA8NNND)
C47  value 0.1 uF  [1005[0402]]  (hidden comment: CL10B104KA8NNND)
C48  value 1 uF  [1608[0603]]  (hidden comment: CL10A105KO8NNNC)
C49  value 47 uF  [3225[1210]]  (hidden comment: GRM32ER71A476KE15L)
C50  value 47 uF  [3225[1210]]  (hidden comment: GRM32ER71A476KE15L)
C51  value 0.1 uF  [1608[0603]]  (hidden comment: CL10B104KA8NNND)
C52  value 0.1 uF  [1608[0603]]  (hidden comment: CL10B104KA8NNND)
C53  value 47 uF  [3225[1210]]  (hidden comment: GRM32ER71A476KE15L)
C54  value 0.1 uF  [1608[0603]]  (hidden comment: CL10B104KA8NNND)
C55  value 47 uF  [3225[1210]]  (hidden comment: GRM32ER71A476KE15L)
C158  value 0.1 uF  [1005[0402]]  (hidden comment: CL10B104KA8NNND)
C159  value 0.1 uF  [1005[0402]]  (hidden comment: CL10B104KA8NNND)
C160  value 100 pF  [1005[0402]]  (hidden comment: CL05C101JB5NNNC)
C161  value 0.1 uF  [1005[0402]]  (hidden comment: CL10B104KA8NNND)
C162  value 0.1 uF  [1005[0402]]  (hidden comment: CL10B104KA8NNND)
C163  value 100 pF  [1005[0402]]  (hidden comment: CL05C101JB5NNNC)
C164  value 100 pF  [1005[0402]]  (hidden comment: CL05C101JB5NNNC)
C165  value 100 pF  [1005[0402]]  (hidden comment: CL05C101JB5NNNC)
D2  BAT54AT-TP  [SOT-523F]
L1  value 120 Ohm, 100 MHz  [1005[0402]]  (hidden comment: MPZ1005S121C)
L2  value 120 Ohm, 100 MHz  [1005[0402]]  (hidden comment: MPZ1005S121C)
L3  value 120 Ohm, 100 MHz  [1005[0402]]  (hidden comment: MPZ1005S121C)
L4  value 120 Ohm, 100 MHz  [1005[0402]]  (hidden comment: MPZ1005S121C)
L5  value 0.47 uH  [IHLP-2020BZ-11]  (hidden comment: IHLP2020BZERR47M11)
L6  value 0.47 uH  [IHLP-2020BZ-11]  (hidden comment: IHLP2020BZERR47M11)
R8  value 10 K  [0402]  (hidden comment: ERJ-3EKF1002V)
R9  value 10 K  [0402]  (hidden comment: ERJ-3EKF1002V)
R10  value 10 K  [0402]  (hidden comment: ERJ-3EKF1002V)
R11  value 10 K  [0402]  (hidden comment: ERJ-3EKF1002V)
R12  value 10 K  [0402]  (hidden comment: ERJ-3EKF1002V)
R13  value 10 K  [0402]  (hidden comment: ERJ-3EKF1002V)
R14  value 10 K  [0402]  (hidden comment: ERJ-3EKF1002V)
R15  value 10 K  [0402]  (hidden comment: ERJ-3EKF1002V)
R16  value 10 K  [0402]  (hidden comment: ERJ-3EKF1002V)
R17  value 100 R  [0603]  (hidden comment: ERJ-3EKF1000V)
R18  value 10 K  [0402]  (hidden comment: ERJ-3EKF1002V)
R19  value DNP  [0603]  (hidden comment: DNP_0603)  (no BOM)
R20  value 0 R  [0603]  (hidden comment: RC0603JR-070RL)
R21  value 10 K  [0603]  (hidden comment: ERJ-3EKF1002V)
R22  value 1 K  [0603]  (hidden comment: RC0603FR-071KL)
R23  value DNP  [0603]  (hidden comment: DNP_0603)  (no BOM)
R24  value 10 K  [0603]  (hidden comment: ERJ-3EKF1002V)
R25  ERJ8RSFR10V  value 0.1 Ohm  Tolerance: 1%  [3216[1206]]
R26  value 210 K  [0603]  (hidden comment: RC0603FR-07210KL)
R27  value 422 K  [0603]  (hidden comment: RC0603FR-07422KL)
R28  value 0 R  [0603]  (hidden comment: RC0603JR-070RL)
R29  value 10 K  [0603]  (hidden comment: ERJ-3EKF1002V)
U2  MK70FN1M0VMJ15  [MAPBGA 256-pin]  (part B of 2)
U3  MT47H64M16HR-25E IT:H TR  [84-Ball BGA]
U4  MT29F2G08ABAEAH4:E TR  [63-BALL VFBGA]
U5  LTC3618EFE#PBF  [24-Lead Plastic TSSOP Linear]

### Nets
+3.3V: C26.2 C27.2 C28.2 C29.2 C30.2 C31.2 C51.2 C52.2 C161.2 C162.2 C163.1 D2.3 L1.2 R19.2 R21.1 R24.2 R25.1 R29.2 U2.G7(VDD) U2.G8(VDD) U2.G9(VDD) U2.G10(VDD) U2.H7(VDDINT) U2.H10(VDDINT) U2.J7(VDD) U2.J10(VDD) U2.K10(VDD) U2.L10(VDD) U4.D3(VCC) U4.G4(VCC) U4.H8(VCC) U4.J6(VCC) U5.12(RT)
GND: B1.1 C6.1 C7.1 C8.1 C9.1 C10.1 C11.1 C12.1 C13.1 C14.1 C15.2 C16.1 C17.1 C18.1 C19.1 C20.1 C21.1 C22.1 C23.1 C24.2 C25.2 C26.1 C27.1 C28.1 C29.1 C30.1 C31.1 C32.1 C33.1 C34.1 C35.1 C36.1 C37.1 C38.1 C39.1 C40.1 C41.1 C46.1 C48.2 C49.1 C50.1 C51.1 C52.1 C53.2 C54.1 C55.2 C158.1 C159.1 C160.2 C161.1 C162.1 C163.2 C164.2 C165.2 L4.2 R18.2 R26.2 U2.A1(DDR_VSS) U2.A5(DDR_VSS) U2.A12(DDR_VSS) U2.A16(DDR_VSS) U2.C7(DDR_VSS) U2.C9(DDR_VSS) U2.C14(DDR_VSS) U2.D5(DDR_VSS) U2.D8(DDR_VSS) U2.D12(DDR_VSS) U2.E3(DDR_VSS) U2.E8(DDR_VSS) U2.E11(DDR_VSS) U2.H8(VSS) U2.H9(VSS) U2.J8(VSS) U2.J9(VSS) U2.K8(VSS) U2.K9(VSS) U2.L2(VSS) U2.L9(VSS) U2.N7(VSS) U2.T4(VSS) U2.T14(VSS) U3.A3(VSS) U3.A7(VSSQ) U3.B2(VSSQ) U3.B8(VSSQ) U3.D2(VSSQ) U3.D8(VSSQ) U3.E3(VSS) U3.E7(VSSQ) U3.F2(VSSQ) U3.F8(VSSQ) U3.H2(VSSQ) U3.H8(VSSQ) U3.J3(VSS) U3.J7(VSSDL) U3.N1(VSS) U3.P9(VSS) U4.C5(VSS) U4.F7(VSS) U4.K3(VSS) U4.K8(VSS) U5.1(PHASE) U5.5(SGND) U5.24(MODE/SYNC) U5.25(PGND)
USB_VBUS: R20.2
VBAT: D2.2 R22.1 R23.1 U2.P5(VBAT)
VBAT_2: R23.2
VDD1V8: C6.2 C7.2 C8.2 C9.2 C10.2 C11.2 C12.2 C13.2 C14.2 C15.1 C16.2 C17.2 C18.2 C19.2 C20.2 C21.2 C22.2 C23.2 C55.1 C158.2 C159.2 C160.1 C164.1 C165.1 L6.2 R27.1 U2.B1(DDR_VDD) U2.B5(DDR_VDD) U2.B8(DDR_VDD) U2.B12(DDR_VDD) U2.C16(DDR_VDD) U2.D2(DDR_VDD) U2.D4(DDR_VDD) U2.D7(DDR_VDD) U2.E10(DDR_VDD) U2.E12(DDR_VDD) U3.A1(VDD) U3.A9(VDDQ) U3.C1(VDDQ) U3.C3(VDDQ) U3.C7(VDDQ) U3.C9(VDDQ) U3.E1(VDD) U3.E9(VDDQ) U3.G1(VDDQ) U3.G3(VDDQ) U3.G7(VDDQ) U3.G9(VDDQ) U3.J1(VDDL) U3.J9(VDD) U3.M9(VDD) U3.R1(VDD) U5.4(VDDQIN)
VDDA: C42.2 C43.1 L1.1 L2.1 U2.N5(VDDA)
VREF_DDR2: C24.1 C25.1 C54.2 U2.C6(DDR_VREF) U3.J2(VREF) U5.14(VTTR)
VSSA: C42.1 C43.2 C47.2 L3.1 L4.1 U2.N4(VSSA)
VTT_DDR2: C32.2 C33.2 C34.2 C35.2 C36.2 C37.2 C38.2 C39.2 C53.1 L5.1 R8.2 R9.2 R10.2 R11.2 R12.2 R13.2 R14.2 R15.2 R16.2 U5.2(VFB2)
DDR_AD0: U2.D10(DDR_A0) U3.M8(A0)
DDR_AD1: U2.C11(DDR_A1) U3.M3(A1)
DDR_AD2: U2.B11(DDR_A2) U3.M7(A2)
DDR_AD3: U2.C12(DDR_A3) U3.N2(A3)
DDR_AD4: U2.C10(DDR_A4) U3.N8(A4)
DDR_AD5: U2.A13(DDR_A5) U3.N3(A5)
DDR_AD6: U2.A14(DDR_A6) U3.N7(A6)
DDR_AD7: U2.D11(DDR_A7) U3.P2(A7)
DDR_AD8: U2.A15(DDR_A8) U3.P8(A8)
DDR_AD9: U2.B15(DDR_A9) U3.P3(A9)
DDR_AD10: U2.B13(DDR_A10) U3.M2(A10)
DDR_AD11: U2.B14(DDR_A11) U3.P7(A11)
DDR_AD12: U2.C15(DDR_A12) U3.R2(A12)
DDR_BA0: R8.1 U2.A9(DDR_BA0) U3.L2(BA0)
DDR_BA1: R9.1 U2.B10(DDR_BA1) U3.L3(BA1)
DDR_BA2: R10.1 U2.B9(DDR_BA2) U3.L1(BA2)
DDR_CAS: R13.1 U2.C13(DDR_CAS#) U3.L7(CAS)
DDR_CK_N: R17.2 U2.A10(DDR_CK#) U3.K8(CK#)
DDR_CK_P: R17.1 U2.A11(DDR_CK) U3.J8(CK)
DDR_CKE: R15.1 R18.1 U2.B16(DDR_CKE) U3.K2(CKE)
DDR_CS: R11.1 U2.D14(DDR_CS#) U3.L8(CS#)
DDR_DQ0: U2.C5(DDR_DQ0) U3.G8(DQ0)
DDR_DQ1: U2.B4(DDR_DQ1) U3.G2(DQ1)
DDR_DQ2: U2.A4(DDR_DQ2) U3.H7(DQ2)
DDR_DQ3: U2.B6(DDR_DQ3) U3.H3(DQ3)
DDR_DQ4: U2.D6(DDR_DQ4) U3.H1(DQ4)
DDR_DQ5: U2.A6(DDR_DQ5) U3.H9(DQ5)
DDR_DQ6: U2.B7(DDR_DQ6) U3.F1(DQ6)
DDR_DQ7: U2.A8(DDR_DQ7) U3.F9(DQ7)
DDR_DQ8: U2.D1(DDR_DQ8) U3.C8(DQ8)
DDR_DQ9: U2.C1(DDR_DQ9) U3.C2(DQ9)
DDR_DQ10: U2.C2(DDR_DQ10) U3.D7(DQ10)
DDR_DQ11: U2.B2(DDR_DQ11) U3.D3(DQ11)
DDR_DQ12: U2.C3(DDR_DQ12) U3.D1(DQ12)
DDR_DQ13: U2.C4(DDR_DQ13) U3.D9(DQ13)
DDR_DQ14: U2.B3(DDR_DQ14) U3.B1(DQ14)
DDR_DQ15: U2.A2(DDR_DQ15) U3.B9(DQ15)
DDR_DQM0: U2.D9(DDR_DM0) U3.F3(LDM)
DDR_DQM1: U2.A3(DDR_DM1) U3.B3(UDM)
DDR_DQS0: U2.C8(DDR_DQS0) U3.F7(LDQS)
DDR_DQS1: U2.D3(DDR_DQS1) U3.B7(UDQS)
DDR_ODT: R16.1 U2.A7(DDR_ODT) U3.K9(ODT)
DDR_PWR_ON: R28.1
DDR_RAS: R14.1 U2.E16(DDR_RAS#) U3.K7(RAS#)
DDR_WE: R12.1 U2.D13(DDR_WE#) U3.K3(WE#)
NFC_ALE: U4.C4(ALE)
NFC_CE: U4.C6(~{CE})
NFC_CLE: U4.D5(CLE)
NFC_D0: U4.H4(I/O0)
NFC_D1: U4.J4(I/O1)
NFC_D2: U4.K4(I/O2)
NFC_D3: U4.K5(I/O3)
NFC_D4: U4.K6(I/O4)
NFC_D5: U4.J7(I/O5)
NFC_D6: U4.K7(I/O6)
NFC_D7: U4.J8(I/O7)
NFC_RDY: R21.2 U4.C8(R/~{B})
NFC_RE: U4.D4(~{RE})
NFC_WE: U4.C7(~{WE})
NFC_WP: U4.C3(~{WP})
NetB1_2: B1.2 R22.2
NetC40_2: C40.2 C41.2 R19.1 U2.L1(VOUT33)
NetC44_1: C44.1 C45.2 L3.2 U2.M4(VREFL)
NetC44_2: C44.2 C45.1 L2.2 U2.P4(VREFH)
NetC46_2: C46.2 R20.1 U2.L3(VREGIN)
NetC47_1: C47.1 U2.T3(VREF_OUT_._CMP1_IN5_._CMP0_IN5_._ADC1_SE18)
NetC48_1: C48.1 C49.2 C50.2 R25.2 U5.3(ITH2) U5.6(PVIN2) U5.7(PVIN2) U5.18(PVIN1) U5.19(PVIN1) U5.20(SVIN) U5.21(TRACK/SS1) U5.23(ITH1)
NetL5_2: L5.2 U5.8(SW2) U5.9(SW2)
NetL6_1: L6.1 U5.16(SW1) U5.17(SW1)
NetR24_1: R24.1 U4.G5(LOCK)
NetR26_1: R26.1 R27.2 U5.22(FB1)
NetR28_2: R28.2 R29.1 U5.10(RUN2) U5.11(RUN1)

Not connected (* = marked no-connect by the designer): D2 1; U2 D15(DDR_A14) D16(DDR_A13); U3 A2(NC) A8(UDQS#_NU) E2(NC) E8(LDQS#_NU) R3(RFU) R7(RFU) R8(RFU); U4 G3(DNU)*; U5 13(PGOOD2) 15(PGOOD1)

### Layout directives
differential pair: DDR_CK_N, DDR_CK_P
net class DDR_DQ: DDR_DQ0, DDR_DQ1, DDR_DQ2, DDR_DQ3, DDR_DQ4, DDR_DQ5, DDR_DQ6, DDR_DQ7, DDR_DQ8, DDR_DQ9, DDR_DQ10, DDR_DQ11, DDR_DQ12, DDR_DQ13, DDR_DQ14, DDR_DQ15, DDR_DQM0, DDR_DQM1, DDR_DQS0, DDR_DQS1
net class DDR_ADDR: DDR_AD0, DDR_AD1, DDR_AD2, DDR_AD3, DDR_AD4, DDR_AD5, DDR_AD6, DDR_AD7, DDR_AD8, DDR_AD9, DDR_AD10, DDR_AD11, DDR_AD12, DDR_BA0, DDR_BA1, DDR_BA2, DDR_CAS, DDR_RAS, DDR_WE
net class DDR_CTRL: DDR_CKE, DDR_CS, DDR_ODT
net class DDR_CLOCK: DDR_CK_N, DDR_CK_P
net class NFC_DATA: NFC_D0, NFC_D1, NFC_D2, NFC_D3, NFC_D4, NFC_D5, NFC_D6, NFC_D7
net class NFC_CTRL: NFC_ALE, NFC_CE, NFC_CLE, NFC_RDY, NFC_RE, NFC_WE, NFC_WP

### Notes on the sheet
- Vmax = 5.5V
- (near U4) -40...+85
- (near U4) VCC=2.7...3.6 V
- (near U4) DNP for unloked state
- (near R24) DNP

### Library data of the parts
B1 = VL2320-1HF: Rechargeable Litium battery, Sanyo, 100 mAh, 3.1 V; PartNum: P083-ND; Manufacturer: Panasonic - BSG; Price: 5.85$; Distributor: Digi-Key; PartName: VL2320-1HF; Price50: 4.68$; Price100: 4.1$; Price1000: 3.51$
C6-C14 C16-C39 C41 C42 C44 C46 C47 C158 C159 C161 C162 = GRM155R71C104KA88D: as C5 on sheet Sheet1; Tolerance: 10%; Distributor: Digi-Key; Price: 0.005$; Voltage: 16 V
C15 C49 C50 C53 C55 = GRM32ER71A476KE15L: 47.0 uF, 10V, 10%, X7R, 1210; Manufacturer: Murata Electronics North America; PartNum: 490-5312-2-ND; Tolerance: 10%; Price: 3.3; Distributor: Digi-Key; Voltage: 10V; PartName: GRM32ER71A476KE15L
C40 = LMK107BJ475KA-T: 4.7 uF, 10V, 10%, X5R, 0603; Manufacturer: Taiyo Yuden; PartNum: 587-1441-1-ND; Tolerance: +-10%; Distributor: Digi-Key; Price: 0.23$; PartName: LMK107BJ475KA-T; Voltage: 10 V
C43 C45 = GRM155R71C103KA01D_1: 10 nF, 16V, 10%, X7R, 0402; Manufacturer: SAMSUNG; Tolerance: 10%; Distributor: Future; Price: 0.02$; PartNum: CL05B103KB5NNNC; Voltage: 16 V; PartName: CL05B103KB5NNNC
C48 = GRM188R60J105KA01D: 1.0 uF, 16V, 10%, X5R, 0603; Manufacturer: SAMSUNG; Tolerance: 10%; Distributor: Future; Price: 0.0037 Euro; PartNum: CL10A105KO8NNNC; Voltage: 16 V; PartName: CL10A105KO8NNNC; Price50: 0.0037 Euro; Price100: 0.0037 Euro; Price1000: 0.0037 Euro
C51 C52 C54 = CVNF100K0603-25: 0.1 uF, 25V, 10% , X7R,  0603 SMD MLC Capacitor; Manufacturer: SAMSUNG; Tolerance: 10%; Distributor: Future; Price: 0.0026 Euro; PartNum: CL10B104KA8NNND; Voltage: 25 V; PartName: CL10B104KA8NNND; Price50: 0.0026 Euro; Price100: 0.0026 Euro; Price1000: 0.0026 Euro
C160 C163-C165 = GRM1555C1H101JZ01D_1: 100 pF, 50V 5% C0G 0402; Manufacturer: SAMSUNG; Tolerance: 5%; Price: 0.003$; Distributor: Future; PartNum: CL05C101JB5NNNC; Voltage: 50 V; PartName: CL05C101JB5NNNC
D2 = BAT54AT-TP: as D1 on sheet Sheet1; Distributor: Digi-Key; Price: 0.52$; PartName: BAT54AT-TP
L1-L4 = MPZ1005S121C: Ferrite bead, 120 Ohm, 100 MHz,  1.2 A, 0.09 Ohm, 0402; Manufacturer: TDK Corporation; PartNum: 445-2981-1-ND; Distributor: Digi-Key; Price: 0.1$; PartName: MPZ1005S121C
L5 L6 = IHLP2020BZERR47M11: Inductors 0.47H, 8 A, 7 mOhms, +-20%,- 55 C to + 125 C; Manufacturer: Vishay Dale; PartNum: 541-1215-2-ND; Tolerance: ±20%; Distributor: Digi-Key; Price: 3.2; PartName: IHLP2020BZERR47M11
R8-R16 R18 = RC0402JR-0710KL: as R2 on sheet Sheet1; Distributor: Digi-Key; Price: 0.1$; Tolerance: 5%; PartName: RC0402JR-0710KL
R17 = RL0603E100-1: 100 R, 1%, 0603, SMD Resistor, Taped; Manufacturer: PANASONIC; Voltage: 75 V; Distributor: Future; Price: 0.0017$; Tolerance: 1%; PartNum: ERJ-3EKF1000V; PartName: ERJ-3EKF1000V; Price50: 0.0015 Euro; Price100: 0.0015 Euro; Price1000: 0.0015 Euro
R19 R23 = DNP_0603: DNP, 0603
R20 R28 = RL0603E000: 0 R, 5%, 0603, SMD Resistor, Taped; Manufacturer: YAGEO AMERICA CORPORATION; Voltage: 75 V; Distributor: Future; Price: 0.0017$; Tolerance: 5%; PartNum: RC0603JR-070RL; PartName: RC0603JR-070RL; Price50: 0.0017$; Price100: 0.0017$; Price1000: 0.0017$
R21 R24 R29 = RL0603K010-1: 10 K, 1%, 0603, SMD Resistor, Taped; Manufacturer: PANASONIC; Voltage: 75 V; Distributor: Future; Price: 0.0015 Euro; Tolerance: 1%; PartNum: ERJ-3EKF1002V; PartName: ERJ-3EKF1002V; Price50: 0.0015 Euro; Price100: 0.0015 Euro; Price1000: 0.0015 Euro
R22 = RL0603K001-1: 1 K, 1%, 0603, SMD Resistor, Taped; Manufacturer: YAGEO AMERICA CORPORATION; Voltage: 75 V; Distributor: Future; Price: 0.0017$; Tolerance: 1%; PartNum: RC0603FR-071KL; PartName: RC0603FR-071KL; Price50: 0.0017$; Price100: 0.0017$; Price1000: 0.0017$
R25 = ERJ8RSFR10V: 0.1 Ohm, 0.25 W, 1% 1206; Manufacturer: Panasonic; Distributor: Farnell; Price: 1.06; PartNum: ERJ8RSFR10V
R26 = RC0603FR-07210KL: 210 K, 1%, 0603, SMD Resistor; Manufacturer: Yageo; PartNum: 311-210KHRTR-ND; Voltage: 75 V; Distributor: Digi-Key; Price: 0.004; Tolerance: 1%; PartName: RC0603FR-07210KL
R27 = RC0603FR-07422KL: 422 K, 1%, 0603, SMD Resistor; Manufacturer: Yageo; PartNum: 311-422KHRTR-ND; Voltage: 75 V; Distributor: Digi-Key; Price: 0.004; Tolerance: 1%; PartName: RC0603FR-07422KL
U2 = MK70FN1M0VMJ15: as U2 on sheet Sheet1; PartName: MK70FN1M0VMJ15; Price: 16.5$; Distributor: Digi-Key
U3 = MT47H64M16HR-25E IT:H TR: IC DDR2 SDRAM 1GBIT 2.5NS 84FBGA; Manufacturer: Micron Technology Inc; PartNum: 557-1522-1-ND; Distributor: Digi-Key; PartName: MT47H64M16HR-25E IT:H TR
U4 = MT29F2G08ABAEAH4:E TR: NAND FLASH 2GB 1.8V 63-VFBGA; Manufacturer: Micron Technology Inc; PartNum: 557-1486-1-ND; Ordered: Digi-Key; Price: 5.8$; Distributor: AVNET; Price50: 3.51$; Price100: 3.51$; Price1000: 3.51$; PartName: MT29F2G08ABAEAH4:E
U5 = LTC3618EFE#PBF: IC REG DUAL SYNC 3A BUCK 24TSSOP; Manufacturer: Linear Technology; PartNum: LTC3618EFE#PBF-ND; Distributor: Digi-Key; PartName: LTC3618EFE#PBF; price: 6.4$